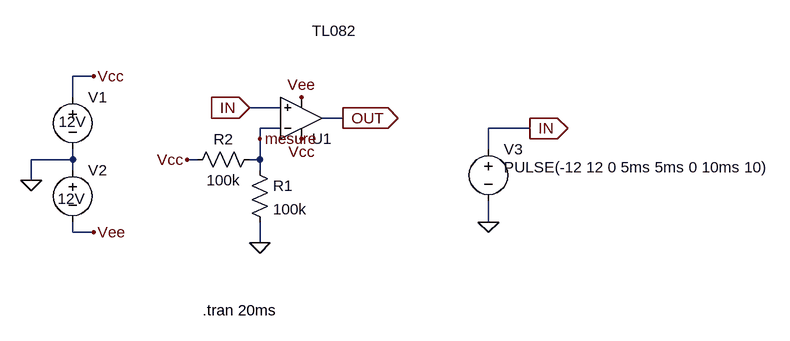
[diagram p0: schematic simple-1.asc]
* simple-1.asc
* U1: TL082 (symbol OpAmp.Add\TL082 not available, pins judged from their places): In+=IN In-=mesure V+=Vcc V-=Vee OUT=OUT
R1 mesure 0 100k
R2 mesure Vcc 100k
V1 Vcc 0 12V
V2 0 Vee 12V
V3 IN 0 PULSE(-12 12 0 5ms 5ms 0 10ms 10) AC 1
.tran 20ms
.backanno
.end

* Results of the author's LTspice run, read from the files saved beside the schematic
* Operating Point, zero values left out:
*   V(mesure) = 6 V
*   V(in) = -12 V
*   V(vcc) = 12 V
*   V(vee) = -12 V
*   V(out) = -10.54 V
*   I(R2) = -60 µA
*   I(R1) = 60 µA
*   I(V3) = 89.98 µA
*   I(V2) = -1.75 mA
*   I(V1) = -1.9 mA
*   Ix(u1:1) = -89.98 µA
*   Ix(u1:2) = 169.6 pA
*   Ix(u1:99) = 1.84 mA
*   Ix(u1:50) = -1.75 mA
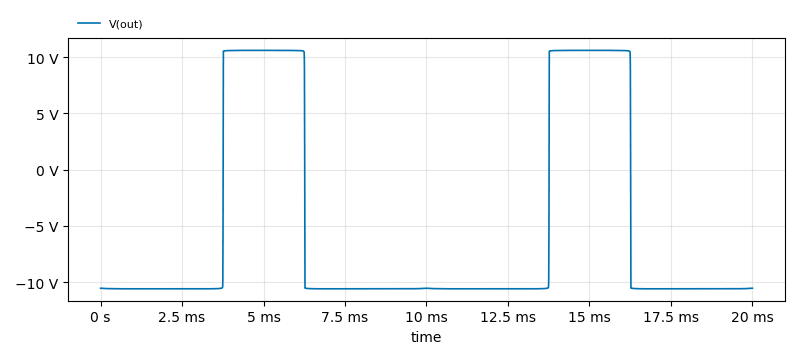
[diagram p1: Transient Analysis of simple-1.asc, plotted from the saved traces]
* Transient Analysis, 1 run:
*   V(out): min -10.59 V, max 10.59 V, average -5.29 V, rms 10.58 V, last -10.54 V